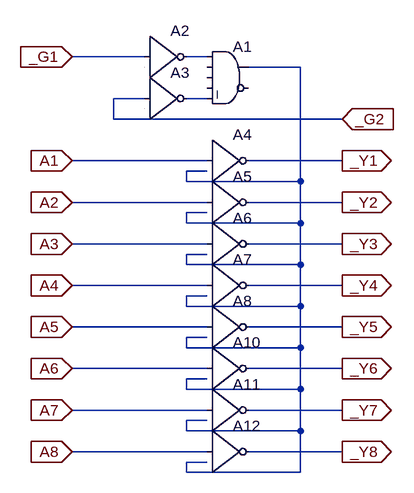
[diagram p0: schematic 74hc540.asc]
74hc540.asc, the LTspice schematic file:
Version 4
SHEET 1 880 792
WIRE -80 112 -192 112
WIRE 16 112 -16 112
WIRE 160 128 80 128
WIRE -80 176 -128 176
WIRE 16 176 -16 176
WIRE -128 208 -128 176
WIRE 224 208 -128 208
WIRE 16 272 -192 272
WIRE 224 272 80 272
WIRE 16 288 -16 288
WIRE -16 304 -16 288
WIRE 160 304 160 128
WIRE 160 304 -16 304
WIRE 16 336 -192 336
WIRE 224 336 80 336
WIRE 16 352 -16 352
WIRE -16 368 -16 352
WIRE 160 368 160 304
WIRE 160 368 -16 368
WIRE 16 400 -192 400
WIRE 224 400 80 400
WIRE 16 416 -16 416
WIRE -16 432 -16 416
WIRE 160 432 160 368
WIRE 160 432 -16 432
WIRE 16 464 -192 464
WIRE 224 464 80 464
WIRE 16 480 -16 480
WIRE -16 496 -16 480
WIRE 160 496 160 432
WIRE 160 496 -16 496
WIRE 16 528 -192 528
WIRE 224 528 80 528
WIRE 16 544 -16 544
WIRE -16 560 -16 544
WIRE 160 560 160 496
WIRE 160 560 -16 560
WIRE 16 592 -192 592
WIRE 224 592 80 592
WIRE 16 608 -16 608
WIRE -16 624 -16 608
WIRE 160 624 160 560
WIRE 160 624 -16 624
WIRE 16 656 -192 656
WIRE 224 656 80 656
WIRE 16 672 -16 672
WIRE -16 688 -16 672
WIRE 160 688 160 624
WIRE 160 688 -16 688
WIRE 16 720 -192 720
WIRE 224 720 80 720
WIRE 16 736 -16 736
WIRE -16 752 -16 736
WIRE 160 752 160 688
WIRE 160 752 -16 752
FLAG -192 112 _G1
IOPIN -192 112 In
FLAG -192 272 A1
IOPIN -192 272 In
FLAG -192 336 A2
IOPIN -192 336 In
FLAG -192 400 A3
IOPIN -192 400 In
FLAG -192 464 A4
IOPIN -192 464 In
FLAG -192 528 A5
IOPIN -192 528 In
FLAG -192 592 A6
IOPIN -192 592 In
FLAG -192 656 A7
IOPIN -192 656 In
FLAG -192 720 A8
IOPIN -192 720 In
FLAG 224 272 _Y1
IOPIN 224 272 Out
FLAG 224 336 _Y2
IOPIN 224 336 Out
FLAG 224 400 _Y3
IOPIN 224 400 Out
FLAG 224 464 _Y4
IOPIN 224 464 Out
FLAG 224 528 _Y5
IOPIN 224 528 Out
FLAG 224 592 _Y6
IOPIN 224 592 Out
FLAG 224 656 _Y7
IOPIN 224 656 Out
FLAG 224 720 _Y8
IOPIN 224 720 Out
FLAG 224 208 _G2
IOPIN 224 208 In
SYMBOL Digital\\and 48 80 R0
SYMATTR InstName A1
SYMBOL Digital\\inv -80 48 R0
SYMATTR InstName A2
SYMBOL Digital\\inv -80 112 R0
SYMATTR InstName A3
SYMBOL Digital\\inv 16 208 R0
SYMATTR InstName A4
SYMBOL Digital\\inv 16 272 R0
SYMATTR InstName A5
SYMBOL Digital\\inv 16 336 R0
SYMATTR InstName A6
SYMBOL Digital\\inv 16 400 R0
SYMATTR InstName A7
SYMBOL Digital\\inv 16 464 R0
SYMATTR InstName A8
SYMBOL Digital\\inv 16 528 R0
SYMATTR InstName A10
SYMBOL Digital\\inv 16 592 R0
SYMATTR InstName A11
SYMBOL Digital\\inv 16 656 R0
SYMATTR InstName A12

The netlist it stands for:
* 74hc540.asc
A1 N001 0 0 0 N003 0 N002 0 AND
A2 _G1 0 0 0 0 N001 0 0 BUF
A3 _G2 0 0 0 0 N003 0 0 BUF
A4 A1 N002 N002 N002 N002 _Y1 N002 N002 BUF
A5 A2 N002 N002 N002 N002 _Y2 N002 N002 BUF
A6 A3 N002 N002 N002 N002 _Y3 N002 N002 BUF
A7 A4 N002 N002 N002 N002 _Y4 N002 N002 BUF
A8 A5 N002 N002 N002 N002 _Y5 N002 N002 BUF
A10 A6 N002 N002 N002 N002 _Y6 N002 N002 BUF
A11 A7 N002 N002 N002 N002 _Y7 N002 N002 BUF
A12 A8 N002 N002 N002 N002 _Y8 N002 N002 BUF
.backanno
.end